# Altium schematic sheet bmsMaster_conn.SchDoc
size A; SheetNumber: 2; SheetTotal: 7
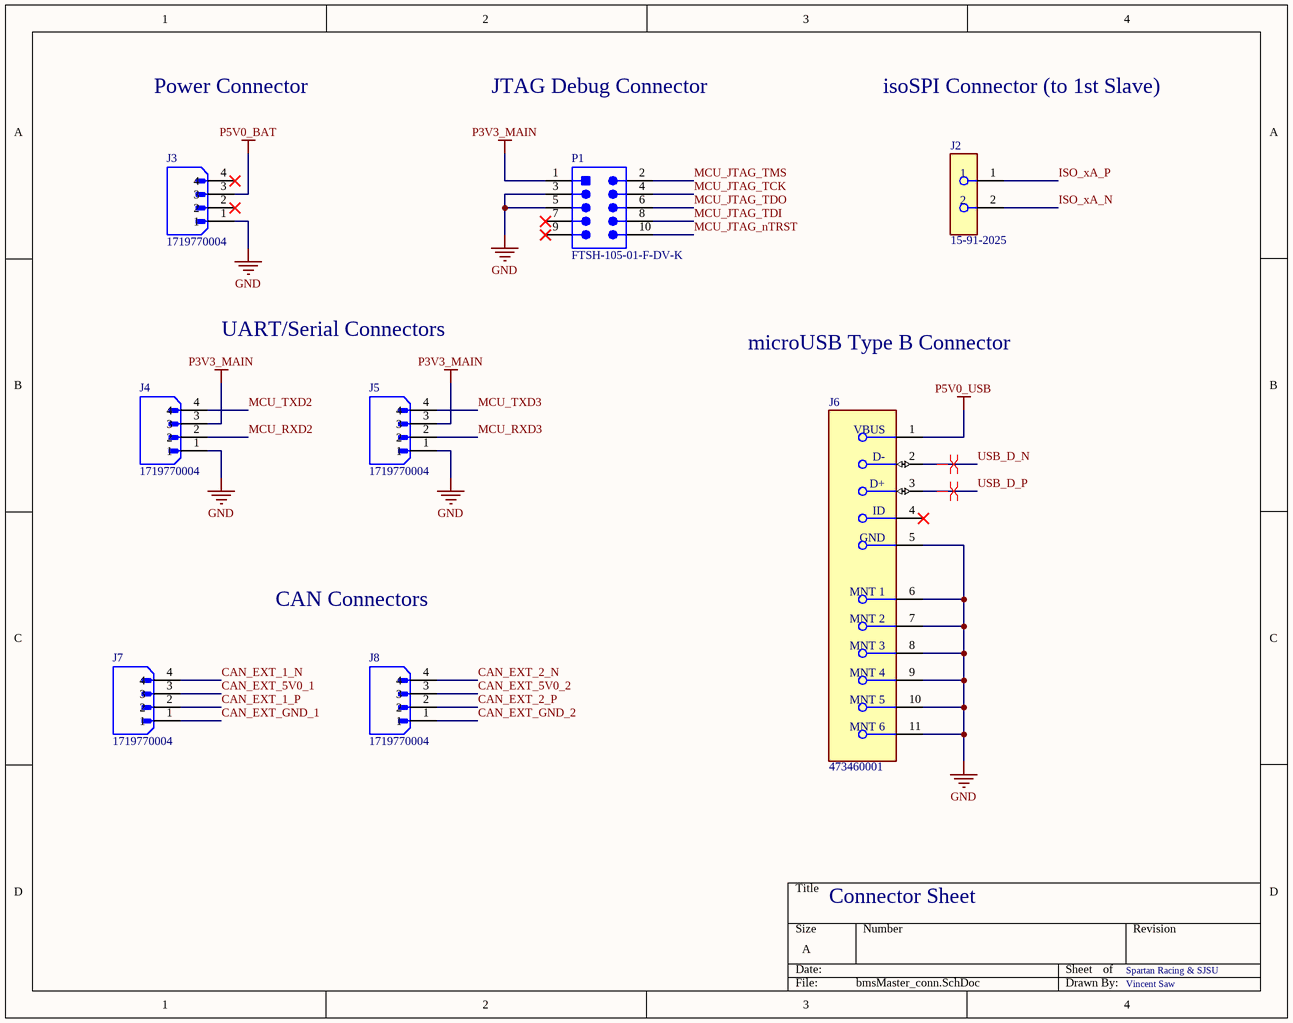
[diagram p0: bmsMaster_conn.SchDoc]

## Parts
J2  15-91-2025  [FP-15-91-2025-MFG]
J3  1719770004  [MOLEX_1719770004]
J4  1719770004  [MOLEX_1719770004]
J5  1719770004  [MOLEX_1719770004]
J6  473460001  [FP-473460001-MFG]
J7  1719770004  [MOLEX_1719770004]
J8  1719770004  [MOLEX_1719770004]
P1  FTSH-105-01-F-DV-K  [SMTC-FTSH-105-01-L-DV-K_V]

## Nets
GND: J3.1 J4.1 J5.1 J6.5(GND) J6.6(MNT_1) J6.7(MNT_2) J6.8(MNT_3) J6.9(MNT_4) J6.10(MNT_5) J6.11(MNT_6) P1.3 P1.5
P3V3_MAIN: J4.3 J5.3 P1.1
P5V0_BAT: J3.3
P5V0_USB: J6.1(VBUS)
CAN_EXT_1_N: J7.4
CAN_EXT_1_P: J7.2
CAN_EXT_2_N: J8.4
CAN_EXT_2_P: J8.2
CAN_EXT_5V0_1: J7.3
CAN_EXT_5V0_2: J8.3
CAN_EXT_GND_1: J7.1
CAN_EXT_GND_2: J8.1
ISO_xA_N: J2.2
ISO_xA_P: J2.1
MCU_JTAG_nTRST: P1.10
MCU_JTAG_TCK: P1.4
MCU_JTAG_TDI: P1.8
MCU_JTAG_TDO: P1.6
MCU_JTAG_TMS: P1.2
MCU_RXD2: J4.2
MCU_RXD3: J5.2
MCU_TXD2: J4.4
MCU_TXD3: J5.4
USB_D_N: J6.2(D-)
USB_D_P: J6.3(D+)

Not connected (* = marked no-connect by the designer): J3 2* 4*; J6 4(ID)*; P1 7* 9*

## Layout directives
differential pair: USB_D_N, USB_D_P

## Notes on the sheet
- Power Connector
- JTAG Debug Connector
- isoSPI Connector (to 1st Slave)
- UART/Serial Connectors
- microUSB Type B Connector
- CAN Connectors
- Connector Sheet
- Spartan Racing & SJSU
- Vincent Saw

## Library data of the parts
J2 = CMP-04776-000618-1: CONN HEADER SMD R/A 2POS 2.54MM; Number of Contacts: 2; Voltage Rating: 250V; Max Current Rating: 1.75A; Contact Resistance: 30mR; Current Rating: 3A; Insulation Resistance: 1GR; Gender: Male; Glow Wire Compliant: Non-compliant; Contact Mating Length: 0.24inch; Max Operating Temperature: 105°C; Length: 8.64mm; Color: Black; REACH SVHC: No SVHC; Depth: 13.59mm; ELV: Compliant; Material: Brass; Contact Type: Male Pin; Number of Rows: 1; Number of Positions: 2; Housing Color: Black; Pitch: 2.54mm; Housing Material: Polyester; Flammability Rating: UL94 V-0; Packaging: Rail/Tube; RoHS Compliant: Yes; Radiation Hardening: No; Min Operating Temperature: -40°C; Termination: Solder; Mount: Surface Mount; Contact Plating: Gold; Package Quantity: 1830; Height: 5.56mm; Contact Material: Bronze; Orientation: Right Angle; Number of Circuits: 2; Lead Free: Contains Lead; Voltage Rating (DC): 250V; Series: C-Grid® SL™ 70634; Contact Gender: Male
J3-J5 J7 J8 = 1719770004: 2.54mm Pitch SL Header, Single Row, Right-Angle, LCP, Shrouded, Surface Mount, with Pegs, Matte Tin (Sn) Plating, 4 Circuits, Tube; MF: {'manufacturer': u'Molex'}; Price: None; Value: *; MP: 1719770004; Package: None; Availability: Unavailable
J6 = CMP-2000-05246-2: CONN RCPT USB2.0 MICRO B SMD R/A; Manufacturer: Molex; Conn Orientation: Right Angle; Is Female: yes; Shielding: true; Pitch: 0.65mm; Number Of Contacts: 5; Voltage Rating: 30V; Current Rating: 1.8A; Device Class L2: USB Connectors; Digikey Description: CONN RCPT USB2.0 MICRO B SMD R/A; Height: 2.945mm; RoHS: TRUE; ComponentLink2Description: Datasheet; Octopart: https://octopart.com/47346-0001-molex-7164928; Automotive: No; Package: 0; Category: Conn; Device Class L1: Connectors; Usb Standard: USB 2.0; Temperature: -30°C to +85°C; Temperature Range Low: -30°C; Footprint Url: https://www.molex.com/pdm_docs/sd/473460001_sd.pdf; ComponentLink2URL: https://www.molex.com/webdocs/datasheets/pdf/en-us/0473460001_IO_CONNECTORS.pdf; Lead Free: Yes; Manufacturer Part Number: 473460001; Contact Material: Gold,Nickel; Temperature Range High: +85°C; Device Class L3: unset
P1 = CMP-2000-05352-1: Male Header, Pitch 1.27 mm, 2 x 5 Position, Height 6.12 mm, RoHS, Tube; Manufacturer: Samtec; Number of Positions: 10; Connector Type: Header,Shrouded; Number of Positions Loaded: All; Row Spacing: 0.050"(1.27mm); Fastening Type: -; Package Reference: FTSH-105-01-L-DV-K; Termination: Solder; Package URL: http://suddendocs.samtec.com/prints/ftsh-1xx-xx-xxx-dv-xxx-footprint.pdf; Number of Rows: 2; Contact Finish Thickness: 3µin(0.08µm); Contact Type: MalePin; Manufacturer URL: http://www.samtec.com/; Contact Mating Length: 0.120"(3.05mm); Pitch: 0.050"(1.27mm); Series: FTSH; Features: -; Contact Finish: Gold; Color: Black; Family: RectangularConnectors-Headers,MalePins; Datasheet URL: http://suddendocs.samtec.com/prints/ftsh-1xx-xx-xxx-dv-xxx-mkt.pdf; Package Description: Male Header, Pitch 1.27 mm, 2 x 5 Position, Height 5.97 mm, Tail Length 4.32 mm; Mounting Type: SurfaceMount; Datasheet Version: Rev. ET, 10/1995; Category: Connectors,Interconnects; Packaging: Tube